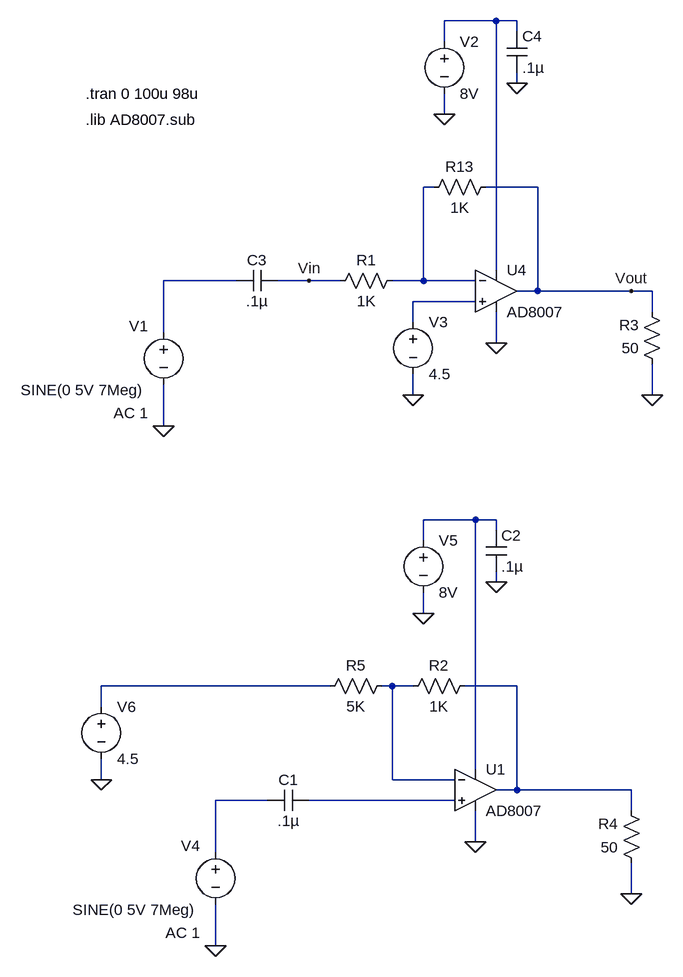
[diagram p0: schematic AD8007 ALC Test.asc]
AD8007 ALC Test.asc, the LTspice schematic file:
Version 4
SHEET 1 2932 996
WIRE 480 -544 400 -544
WIRE 512 -544 480 -544
WIRE 512 -528 512 -544
WIRE 400 -512 400 -544
WIRE 512 -448 512 -464
WIRE 400 -400 400 -432
WIRE 384 -288 368 -288
WIRE 544 -288 464 -288
WIRE 480 -160 480 -544
WIRE 80 -144 -32 -144
WIRE 192 -144 144 -144
WIRE 240 -144 192 -144
WIRE 368 -144 368 -288
WIRE 368 -144 320 -144
WIRE 448 -144 368 -144
WIRE 544 -128 544 -288
WIRE 544 -128 512 -128
WIRE 688 -128 544 -128
WIRE 720 -128 688 -128
WIRE 448 -112 352 -112
WIRE 720 -96 720 -128
WIRE 352 -80 352 -112
WIRE -32 -64 -32 -144
WIRE 480 -48 480 -96
WIRE 352 32 352 0
WIRE 720 32 720 -16
WIRE -32 80 -32 16
WIRE 448 224 368 224
WIRE 480 224 448 224
WIRE 480 240 480 224
WIRE 368 256 368 224
WIRE 480 320 480 304
WIRE 368 368 368 336
WIRE 224 480 -128 480
WIRE 320 480 304 480
WIRE 352 480 320 480
WIRE 512 480 432 480
WIRE -128 512 -128 480
WIRE 448 608 448 224
WIRE -128 624 -128 592
WIRE 320 624 320 480
WIRE 416 624 320 624
WIRE 512 640 512 480
WIRE 512 640 480 640
WIRE 688 640 512 640
WIRE 128 656 48 656
WIRE 416 656 192 656
WIRE 688 672 688 640
WIRE 448 720 448 672
WIRE 48 736 48 656
WIRE 688 800 688 752
WIRE 48 880 48 816
FLAG 400 -400 0
FLAG -32 80 0
FLAG 512 -448 0
FLAG 192 -144 Vin
FLAG 480 -48 0
FLAG 352 32 0
FLAG 720 32 0
FLAG 688 -128 Vout
FLAG 368 368 0
FLAG 48 880 0
FLAG 480 320 0
FLAG 448 720 0
FLAG -128 624 0
FLAG 688 800 0
SYMBOL cap 144 -160 R90
WINDOW 0 0 32 VBottom 2
WINDOW 3 32 32 VTop 2
SYMATTR InstName C3
SYMATTR Value .1µ
SYMBOL voltage -32 -80 R0
WINDOW 3 -220 104 Left 2
WINDOW 123 -77 140 Left 2
WINDOW 39 0 0 Left 2
WINDOW 0 -53 6 Left 2
SYMATTR Value SINE(0 5V 7Meg)
SYMATTR Value2 AC 1
SYMATTR InstName V1
SYMBOL voltage 400 -528 R0
WINDOW 123 0 0 Left 2
WINDOW 39 0 0 Left 2
SYMATTR InstName V2
SYMATTR Value 8V
SYMBOL res 480 -304 R90
WINDOW 0 0 56 VBottom 2
WINDOW 3 32 56 VTop 2
SYMATTR InstName R13
SYMATTR Value 1K
SYMBOL cap 496 -528 R0
SYMATTR InstName C4
SYMATTR Value .1µ
SYMBOL Opamps\\opamp2 480 -192 R0
SYMATTR InstName U4
SYMATTR Value AD8007
SYMBOL res 736 0 R180
WINDOW 0 36 76 Left 2
WINDOW 3 36 40 Left 2
SYMATTR InstName R3
SYMATTR Value 50
SYMBOL res 336 -160 R90
WINDOW 0 0 56 VBottom 2
WINDOW 3 32 56 VTop 2
SYMATTR InstName R1
SYMATTR Value 1K
SYMBOL voltage 352 -96 R0
WINDOW 123 0 0 Left 2
WINDOW 39 0 0 Left 2
SYMATTR InstName V3
SYMATTR Value 4.5
SYMBOL cap 192 640 R90
WINDOW 0 0 32 VBottom 2
WINDOW 3 32 32 VTop 2
SYMATTR InstName C1
SYMATTR Value .1µ
SYMBOL voltage 48 720 R0
WINDOW 3 -220 104 Left 2
WINDOW 123 -77 140 Left 2
WINDOW 39 0 0 Left 2
WINDOW 0 -53 6 Left 2
SYMATTR Value SINE(0 5V 7Meg)
SYMATTR Value2 AC 1
SYMATTR InstName V4
SYMBOL voltage 368 240 R0
WINDOW 123 0 0 Left 2
WINDOW 39 0 0 Left 2
SYMATTR InstName V5
SYMATTR Value 8V
SYMBOL res 448 464 R90
WINDOW 0 0 56 VBottom 2
WINDOW 3 32 56 VTop 2
SYMATTR InstName R2
SYMATTR Value 1K
SYMBOL cap 464 240 R0
SYMATTR InstName C2
SYMATTR Value .1µ
SYMBOL Opamps\\opamp2 448 576 R0
SYMATTR InstName U1
SYMATTR Value AD8007
SYMBOL res 704 768 R180
WINDOW 0 36 76 Left 2
WINDOW 3 36 40 Left 2
SYMATTR InstName R4
SYMATTR Value 50
SYMBOL voltage -128 496 R0
WINDOW 123 0 0 Left 2
WINDOW 39 0 0 Left 2
SYMATTR InstName V6
SYMATTR Value 4.5
SYMBOL res 320 464 R90
WINDOW 0 0 56 VBottom 2
WINDOW 3 32 56 VTop 2
SYMATTR InstName R5
SYMATTR Value 5K
TEXT -152 -392 Left 2 !.lib AD8007.sub
TEXT -152 -432 Left 2 !.tran 0 100u 98u

The netlist it stands for:
* AD8007 ALC Test.asc
C3 Vin N003 .1µ
V1 N003 0 SINE(0 5V 7Meg) AC 1
V2 N001 0 8V
R13 Vout N002 1K
C4 N001 0 .1µ
XU4 N004 N002 N001 0 Vout AD8007  ; pins In+ In- V+ V- OUT
R3 0 Vout 50
R1 N002 Vin 1K
V3 N004 0 4.5
C1 N010 N009 .1µ
V4 N009 0 SINE(0 5V 7Meg) AC 1
V5 N005 0 8V
R2 N008 N007 1K
C2 N005 0 .1µ
XU1 N010 N007 N005 0 N008 AD8007  ; pins In+ In- V+ V- OUT
R4 0 N008 50
V6 N006 0 4.5
R5 N007 N006 5K
.lib AD8007.sub
.tran 0 100u 98u
.backanno
.end